# Altium schematic sheet Capa.SchDoc: CONTROLADORA MAIS PIPOCA - REVISÃO EMC
size A3; Author: Marcos Aquino; DocumentNumber: 1; SheetNumber: 1; SheetTotal: 17; PageSetup: Record=PageOptions|CenterHorizontal=True|CenterVertical=True|PrintScale=0.71|XCorrection=1.00|YCorrection=1.00|PrintKind=0|BorderSize=5000000|LeftOffset=0|BottomOffset=0|Orientation=2|PaperLength=1000|PaperWidth=1000|Scale=100|PaperSource=7|PrintQuality=-3|MediaType=1|DitherType=10|PrintScaleMode=1|PaperKind=A4|PaperIndex=9
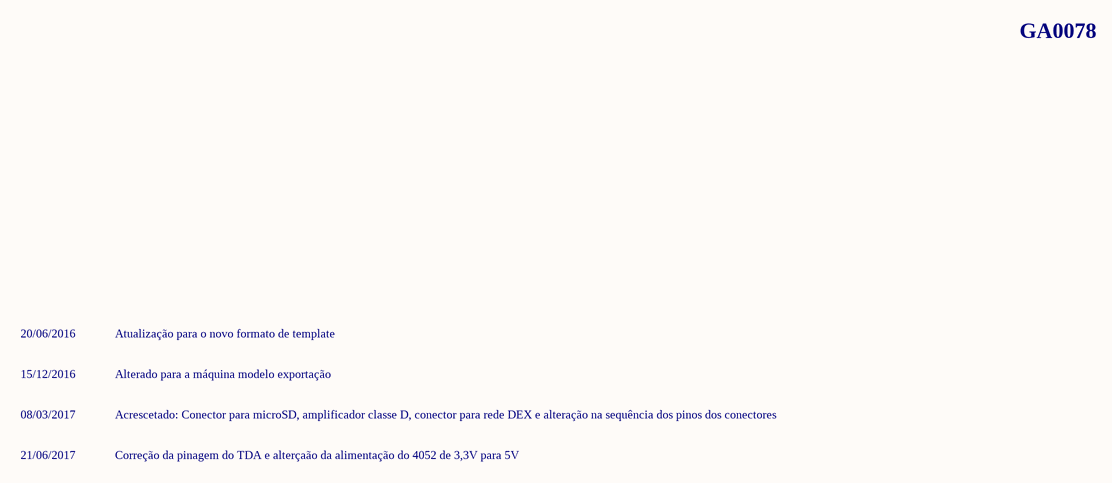
[diagram p0: Capa.SchDoc]

## Notes on the sheet
- GA0078
- 20/06/2016
- 15/12/2016
- Atualização para o novo formato de template
- Alterado para a máquina modelo exportação
- 08/03/2017
- Acrescetado: Conector para microSD, amplificador classe D, conector para rede DEX e alteração na sequência dos pinos dos conectores
- 21/06/2017
- Correção da pinagem do TDA e alterçaão da alimentação do 4052 de 3,3V para 5V
- Código
- Quark Tecnologia Eletrônica Ltda.
- Rua 216, nº 238 - Sala 01 - Meia Praia - Itapema/SC
- Observações
- (47) 3246-6352  -
- www.quarktee.com.br
- contato@quarktee.com.br
- Projeto
- Quantidade de Páginas
- Revisão
- Projetista
- Local arquivos no servidor
- Data
- Modificação
- Solicitador por:
- Executador por:
- Aprovado por: